# EAGLE design flokati-proto-r2 (EAGLE 6.2)
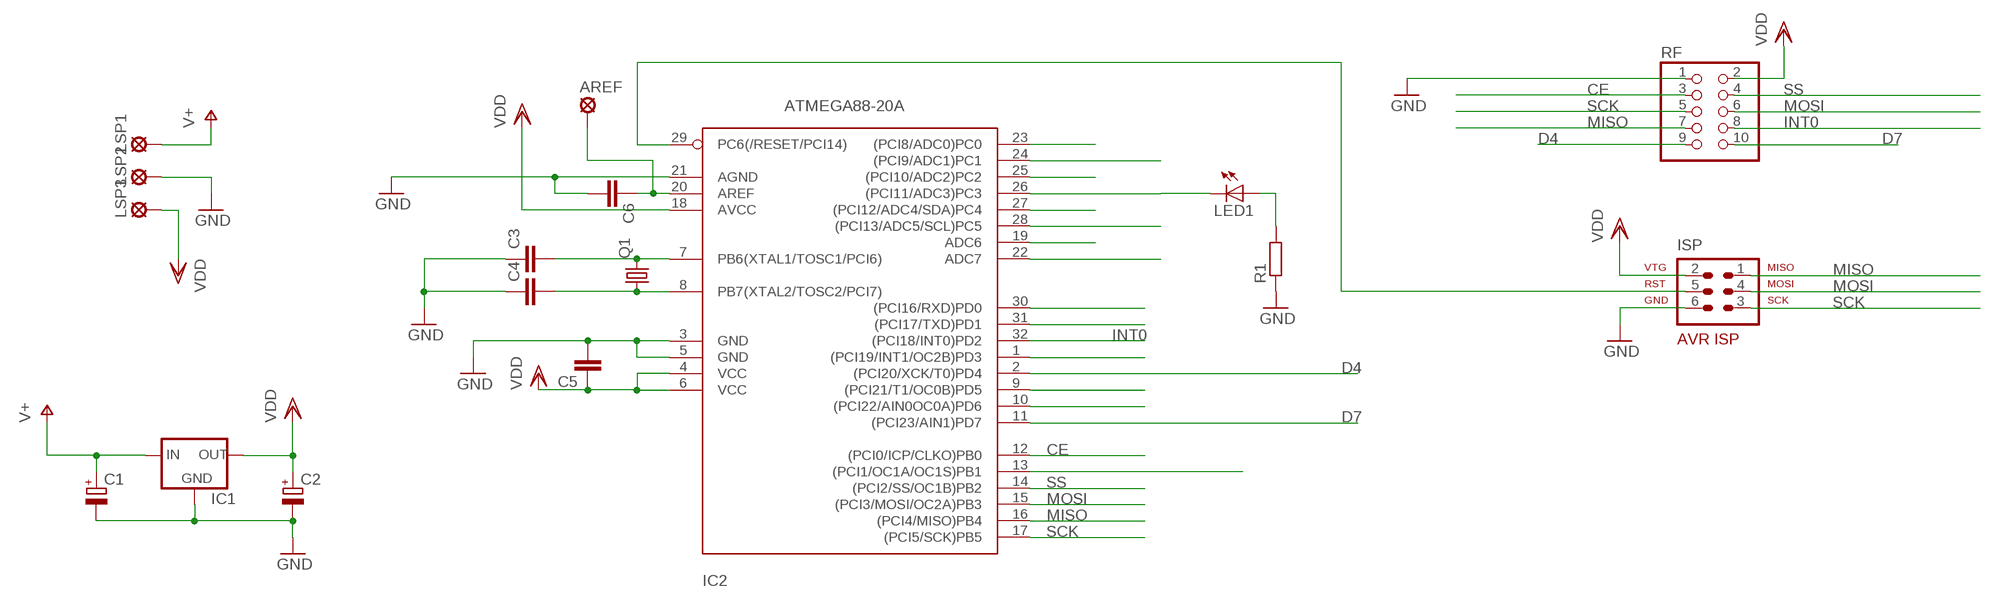
[diagram p0: schematic, sheet 1]

## Parts
AREF  LSP10  [LSP10]
C1  CPOL-EUE2-4  [E2-4]
C2  CPOL-EUE2-4  [E2-4]
C3  C-EUC0805K  [C0805K]
C4  C-EUC0805K  [C0805K]
C5  C-EUC0805K  [C0805K]
C6  C-EUC0805K  [C0805K]
IC1  78XXS  [78XXS]
IC2  ATMEGA88-20A  [TQFP32-08]
ISP  AVR-ISP-6  [AVR-ISP-6]
LED1  LEDCHIP-LED0805  [CHIP-LED0805]
LSP1  LSP11  [LSP11]
LSP2  LSP11  [LSP11]
LSP3  LSP11  [LSP11]
Q1  CRYSTALHC49U70  [HC49U70]
R1  R-EU_M0805  [M0805]
RF  PINHD-2X5  [2X05]

## Nets
CE: IC2.12((PCI0/ICP/CLKO)PB0) RF.3
D4: IC2.2((PCI20/XCK/T0)PD4) RF.9
D7: IC2.11((PCI23/AIN1)PD7) RF.10
GND: C1.- C2.- C3.1 C4.1 C5.2 C6.2 IC1.GND IC2.3(GND) IC2.5(GND) IC2.21(AGND) ISP.6 LSP2.MP R1.1 RF.1
INT0: IC2.32((PCI18/INT0)PD2) RF.8
MISO: IC2.16((PCI4/MISO)PB4) ISP.1 RF.7
MOSI: IC2.15((PCI3/MOSI/OC2A)PB3) ISP.4 RF.6
N$1: C3.2 IC2.7(PB6(XTAL1/TOSC1/PCI6)) Q1.2
N$2: C4.2 IC2.8(PB7(XTAL2/TOSC2/PCI7)) Q1.1
N$3: AREF.MP C6.1 IC2.20(AREF)
N$4: IC2.29(PC6(/RESET/PCI14)) ISP.5
N$5: IC2.23((PCI8/ADC0)PC0)
N$6: IC2.24((PCI9/ADC1)PC1)
N$9: IC2.27((PCI12/ADC4/SDA)PC4)
N$10: IC2.28((PCI13/ADC5/SCL)PC5)
N$11: IC2.19(ADC6)
N$12: IC2.22(ADC7)
N$13: IC2.30((PCI16/RXD)PD0)
N$14: IC2.31((PCI17/TXD)PD1)
N$15: IC2.1((PCI19/INT1/OC2B)PD3)
N$17: IC2.9((PCI21/T1/OC0B)PD5)
N$18: IC2.10((PCI22/AIN0OC0A)PD6)
N$20: IC2.13((PCI1/OC1A/OC1S)PB1)
N$22: IC2.26((PCI11/ADC3)PC3) LED1.C
N$23: IC2.25((PCI10/ADC2)PC2)
N$53: LED1.A R1.2
SCK: IC2.17((PCI5/SCK)PB5) ISP.3 RF.5
SS: IC2.14((PCI2/SS/OC1B)PB2) RF.4
V+: C1.+ IC1.IN LSP1.MP
VDD: C2.+ C5.1 IC1.OUT IC2.4(VCC) IC2.6(VCC) IC2.18(AVCC) ISP.2 LSP3.MP RF.2

## Library data of the parts
AREF = solpad:LSP10: SOLDER PAD drill 1.0 mm, distributor Buerklin, 12H555
C1 C2 = rcl:CPOL-EU: POLARIZED CAPACITOR, European symbol
C3-C6 = rcl:C-EU: CAPACITOR, European symbol
IC1 = v-reg:78XXS: VOLTAGE REGULATOR
IC2 = avr:ATMEGA88: MICROCONTROLLER 8 kBytes FLASH 1 kBytes SRAM 512 Bytes EEPROM USART 8-channel 10 bit ADC
ISP = avr-6:AVR-ISP-6: AVR ISP-6 Serial Programming Header
LED1 = led:LED: LED OSRAM: - CHIPLED LG R971, LG N971, LY N971, LG Q971, LY Q971, LO R971, LY R971 LH N974, LH R974 LS Q976, LO Q976, LY Q976 LO Q996 - Hyper CHIPLED LW Q18S LB Q993, LB Q99A, LB R99A - SideLED LS A670, LO A670, LY A670, LG A670, LP A670 LB A673, LV A673, LT A673, LW A673 LH A674 LY A675 LS A676, LA A676, LO A676, LY A676, LW A676 LS A679, LY A679, LG A679 - Hyper Micro SIDELED® LS Y876, LA Y876, LO Y876, LY Y876 LT Y87S - SmartLED LW L88C, LW L88S LB L89C, LB L89S, LG L890 LS L89K, LO L89K, LY L89K LS L896, LA L896, LO L896, LY L896 - TOPLED LS T670, LO T670, LY T670, LG T670, LP T670 LSG T670, LSP T670, LSY T670, LOP T670, LYG T670 LG T671, LOG T671, LSG T671 LB T673, LV T673, LT T673, LW T673 LH T674 LS T676, LA T676, LO T676, LY T676, LB T676, LH T676, LSB T676, LW T676 LB T67C, LV T67C, LT T67C, LS T67K, LO T67K, LY T67K, LW E67C LS E67B, LA E67B, LO E67B, LY E67B, LB E67C, LV E67C, LT E67C LW T67C LS T679, LY T679, LG T679 LS T770, LO T770, LY T770, LG T770, LP T770 LB T773, LV T773, LT T773, LW T773 LH T774 LS E675, LA E675, LY E675, LS T675 LS T776, LA T776, LO T776, LY T776, LB T776 LHGB T686 LT T68C, LB T68C - Hyper Mini TOPLED® LB M676 - Mini TOPLED Santana® LG M470 LS M47K, LO M47K, LY M47K Source: http://www.osram.convergy.de - LUMILED® LXK2-PW12-R00, LXK2-PW12-S00, LXK2-PW14-U00, LXK2-PW14-V00 LXK2-PM12-R00, LXK2-PM12-S00, LXK2-PM14-U00 LXK2-PE12-Q00, LXK2-PE12-R00, LXK2-PE12-S00, LXK2-PE14-T00, LXK2-PE14-U00 LXK2-PB12-K00, LXK2-PB12-L00, LXK2-PB12-M00, LXK2-PB14-N00, LXK2-PB14-P00, LXK2-PB14-Q00 LXK2-PR12-L00, LXK2-PR12-M00, LXK2-PR14-Q00, LXK2-PR14-R00 LXK2-PD12-Q00, LXK2-PD12-R00, LXK2-PD12-S00 LXK2-PH12-R00, LXK2-PH12-S00 LXK2-PL12-P00, LXK2-PL12-Q00, LXK2-PL12-R00 Source: www.luxeon.com
LSP1-LSP3 = solpad:LSP11: SOLDER PAD drill 1.1 mm
Q1 = crystal:CRYSTAL: CRYSTAL
R1 = rcl:R-EU_: RESISTOR, European symbol
RF = pinhead:PINHD-2X5: PIN HEADER

## Board
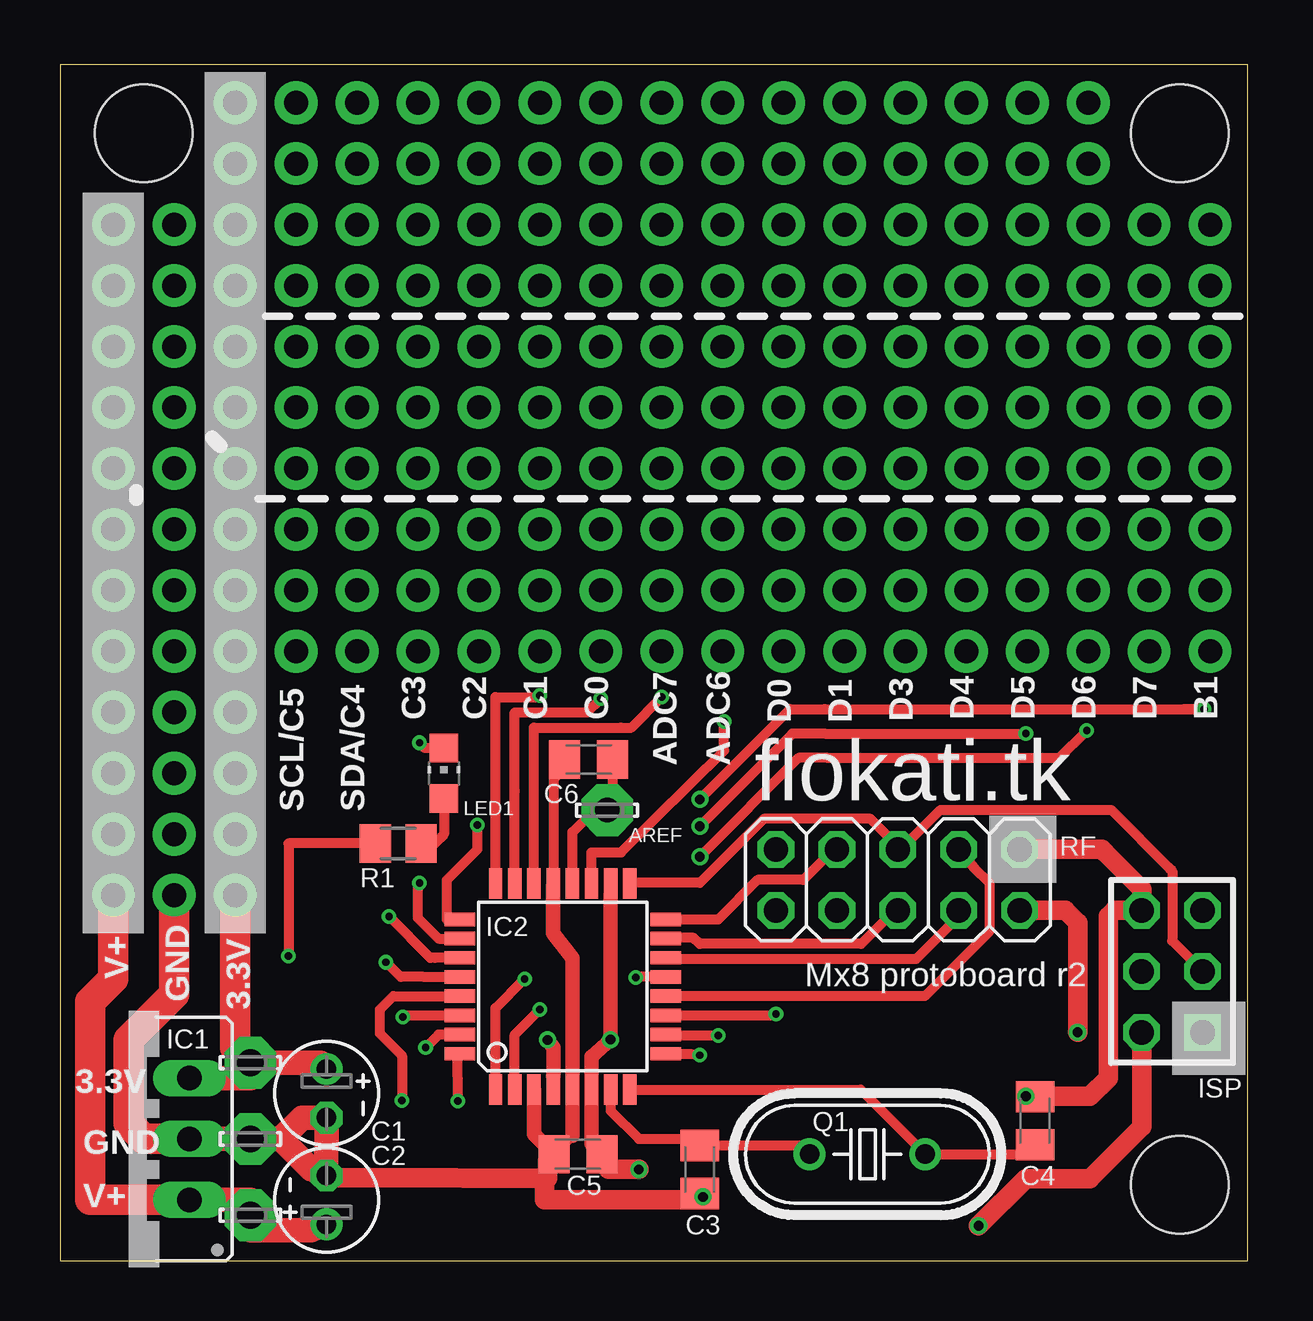
[diagram p1: board, top side]
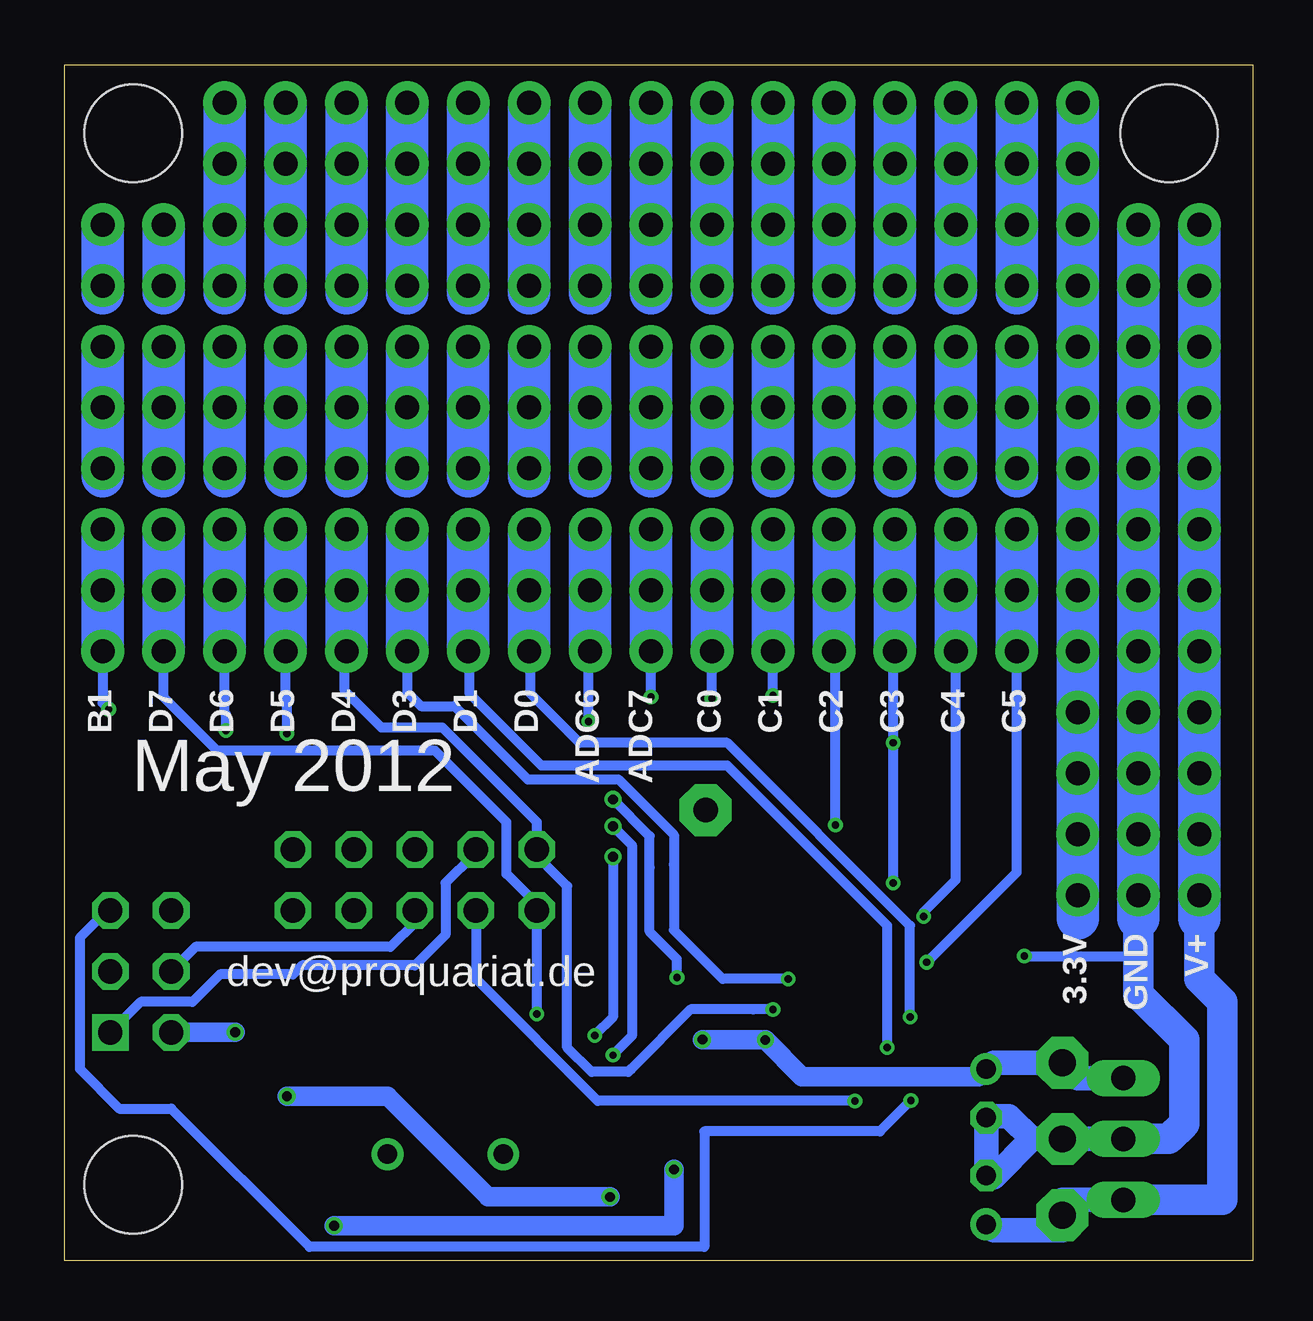
[diagram p2: board, bottom side, seen from below]

Size 49.52 x 49.84 mm. Coordinates in mm from the lower left corner, seen from the top.
Outline: 0,0 49.52,0 49.52,49.84 0,49.84 0,0
Copper layers (1*16): Top 0.035mm / dielectric 1.5mm / Bottom 0.035mm
Design rules: minimum track width 6mil, minimum drill 12mil, track to track 6mil, track to pad 6mil, pad to pad 6mil, via to via 6mil, smd to smd 0mil, copper to edge 10mil, drill to drill 10mil, minimum pad ring 10mil, minimum via ring 6mil, stop-mask expansion 2mil, vias tented up to drill 100mil, thermal gap 10mil
Holes 4.06 mm at 3.49,46.99 46.67,46.99 46.67,3.17

### Footprints (pad centres in the part's own frame; a part is rotated, then mirrored left to right if it is on the bottom)
LSP10 = drill 1.016 pad 2.159 octagon: MP 0,0
E2-4 = drill 0.813 pad 1.27: + -1.016,0 | drill 0.813 pad 1.27 octagon: - 1.016,0
C0805K = smd 1.3 x 1.6: 1 -1,0; 2 1,0
78XXS = drill 1.016 long: GND 0,-2.54; IN -2.54,-2.54; OUT 2.54,-2.54
TQFP32-08 = smd 1.27 x 0.559: 1 -4.293,2.8; 2 -4.293,2; 3 -4.293,1.2; 4 -4.293,0.4; 5 -4.293,-0.4; 6 -4.293,-1.2; 7 -4.293,-2; 8 -4.293,-2.8; 17 4.293,-2.8; 18 4.293,-2; 19 4.293,-1.2; 20 4.293,-0.4; 21 4.293,0.4; 22 4.293,1.2; 23 4.293,2; 24 4.293,2.8 | smd 0.559 x 1.27: 9 -2.8,-4.293; 10 -2,-4.293; 11 -1.2,-4.293; 12 -0.4,-4.293; 13 0.4,-4.293; 14 1.2,-4.293; 15 2,-4.293; 16 2.8,-4.293; 25 2.8,4.293; 26 2,4.293; 27 1.2,4.293; 28 0.4,4.293; 29 -0.4,4.293; 30 -1.2,4.293; 31 -2,4.293; 32 -2.8,4.293
AVR-ISP-6 = drill 1.016 square: 1 -2.54,-1.27 | drill 1.016 octagon: 2 -2.54,1.27; 3 0,-1.27; 4 0,1.27; 5 2.54,-1.27; 6 2.54,1.27
CHIP-LED0805 = smd 1.2 x 1.2: A 0,-1.05; C 0,1.05
LSP11 = drill 1.118 pad 2.159 octagon: MP 0,0
HC49U70 = drill 0.813: 1 -2.413,0; 2 2.413,0
M0805 = smd 1.3 x 1.6: 1 -0.95,0; 2 0.95,0
2X05 = drill 1.016 octagon: 1 -5.08,-1.27; 2 -5.08,1.27; 3 -2.54,-1.27; 4 -2.54,1.27; 5 0,-1.27; 6 0,1.27; 7 2.54,-1.27; 8 2.54,1.27; 9 5.08,-1.27; 10 5.08,1.27

### Placement (x,y rotation side)
AREF  22.81,18.78 0 top
C1  11.11,2.54 90 top
C2  11.11,6.99 270 top
C3  26.67,3.81 90 top
C4  40.64,5.84 270 top
C5  21.59,4.45 180 top
C6  22.03,20.89 180 top
IC1  2.86,5.08 90 top
IC2  20.95,11.43 90 top
ISP  46.35,12.06 90 top
LED1  16,20.32 0 top
LSP1  7.94,1.91 0 top
LSP2  7.94,5.08 0 top
LSP3  7.94,8.26 0 top
Q1  33.66,4.45 180 top
R1  14.1,17.4 0 top
RF  34.92,15.88 180 top

### Tracks (layer width: path | path; a pad name or v marks a point on that pad's centre or on a via)
CE
  Top 0.406: IC2.12 36.05,11.03 38.73,13.72 38.73,15.75 38.1,16.38 RF.3
D4  (via drill 0.3, 1 pad 1.78)
  Top 0.406: IC2.2 18.95,9.43 v20,10.48
  Bottom 0.406: v20,10.48 20.83,10.48 23.43,10.48 25.91,8 26.04,7.87 27.56,7.87 28.57,8.89 28.57,15.62 30.23,17.27 29.72,17.27 RF.9 29.84,18.29 33.78,22.23 36.32,22.23 37.85,23.75 37.85,25.34 v37.78,25.4
  Bottom 1.778: v37.78,27.94 v37.78,25.4 v37.78,27.94 | v37.78,27.94 v37.78,30.48 v37.78,27.94
D7  (via drill 0.3 pad 0.41, 1 pad 1.78)
  Top 0.406: IC2.11 29.79,10.23 v29.84,10.29
  Bottom 0.406: v45.4,25.4 45.4,23.5 43.88,21.97 43.18,21.27 34.1,21.27 31.11,18.29 31.11,16.13 29.84,14.86 29.84,14.73 RF.10 29.84,14.22 29.84,12.95 v29.84,10.29
  Bottom 1.778: v45.4,25.4 v45.4,27.94 v45.4,30.48
GND  (via drill 0.3 pad 0.41, 0.41 pad 0.41, 1 pad 1.78)
  Top 0.254: C5.2 20.32,3.81
  Top 0.406: C5.2 21.36,5.21 | 26.4,2.54 C3.1 26.67,2.79 v26.8,2.67 | 20.56,15.63 IC2.21 20.57,15.74 20.57,20.07 21.04,20.53 C6.2 | R1.1 9.53,17.4 v9.53,12.7 | v40.26,6.86 40.27,6.84 C4.1 40.66,6.86 | 43.43,17.14 43.56,17.02
  Top 0.61: 21.36,5.21 IC2.5 21.36,12.62 20.56,13.64 20.56,15.63 | IC2.3 19.75,5.28 C5.2
  Top 0.813: 11.09,3.46 16.49,3.46 16.83,3.45 20.19,3.45 | 20.19,3.45 20.32,3.45 20.32,4.17 C5.2 | 26.4,2.54 20.19,2.54 20.19,3.45 | 43.56,17.02 45.09,15.49 ISP.6 43.94,14.61 43.69,14.35 43.69,7.62 42.93,6.86 40.66,6.86 | RF.1 43.43,17.14
  Top 1.016: 9.21,5.08 10.48,3.81 C1.- | 9.21,5.08 LSP2.MP IC1.GND | 9.21,5.08 10.1,5.97 C2.- 11.09,3.46
  Top 1.27: IC1.GND 3.49,5.08 2.86,5.71 2.86,9.21 4.76,11.11 v4.76,15.24
  Bottom 0.406: v9.53,12.7 4.76,12.7
  Bottom 0.813: v26.8,2.67 31.88,2.67 36.07,6.86 v40.26,6.86
  Bottom 1.016: IC1.GND 9.21,5.08 | 9.21,5.08 10.16,6.03 11.11,6.03 11.11,3.49 10.79,3.49 9.21,5.08
  Bottom 1.27: 4.76,14.29 4.76,12.7 4.76,11.11 2.86,9.21 2.86,5.71 3.49,5.08 IC1.GND
  Bottom 1.778: 4.76,14.29 v4.76,15.24 v4.76,17.78 v4.76,20.32 v4.76,22.86 v4.76,25.4 v4.76,27.94 v4.76,30.48 v4.76,33.02 v4.76,35.56 v4.76,38.1 v4.76,40.64 v4.76,43.18
INT0  (via drill 0.3)
  Top 0.406: IC2.32 16.57,8.63 v16.59,6.67
  Bottom 0.406: v16.59,6.67 27.3,6.67 32.38,11.75 RF.8
MISO
  Top 0.406: RF.7 32.13,17.02 30.99,15.88 29.08,15.88 27.43,14.22 IC2.16
  Bottom 0.406: RF.7 32.38,16.89 32.51,16.89 33.66,15.75 33.66,13.59 34.92,12.32 39.62,12.32 40.01,11.94 43.05,11.94 44.07,10.92 44.2,10.79 46.35,10.79 ISP.1
MOSI
  Top 0.406: RF.6 34.67,14.48 33.4,13.21 26.67,13.21 26.42,13.46 25.28,13.46 IC2.15
  Bottom 0.406: RF.6 34.92,14.1 35.94,13.08 44.07,13.08 ISP.4
N$1
  Top 0.406: IC2.7 22.95,6.25 24.13,5.08 26.4,5.08 C3.2 30.88,4.81 Q1.2
N$2
  Top 0.406: IC2.8 33.38,7.14 Q1.1 40.27,4.45 C4.2
N$3
  Top 0.406: IC2.20 21.36,17.86 22.54,19.05 22.92,19.05 AREF.MP 23.04,19 C6.1
N$4  (via drill 0.3)
  Top 0.406: IC2.29 13.89,11.03 13.34,10.48 13.34,9.53 13.34,9.47 14.25,8.56 v14.25,6.69
  Bottom 0.406: v14.25,6.69 15.54,5.4 22.86,5.4 22.86,0.58 39.32,0.58 45.09,6.35 47.24,6.35 48.9,8 48.9,13.46 47.75,14.61 ISP.5
N$5  (via drill 0.3 pad 0.41, 1 pad 1.78)
  Top 0.406: IC2.23 18.95,19.59 18.95,22.86 21.59,22.86 21.97,22.86 v22.54,23.43
  Bottom 0.406: v22.54,23.43 v22.54,25.4
  Bottom 1.778: v22.54,25.4 v22.54,27.94 v22.54,30.48
N$6  (via drill 0.3 pad 0.41, 1 pad 1.78)
  Top 0.406: IC2.24 18.16,23.49 19.94,23.49 19.94,23.5 v20,23.56
  Bottom 0.406: v20,23.56 v20,25.4
  Bottom 1.778: v20,25.4 v20,27.94 v20,30.48
N$7  (via drill 1 pad 1.78)
  Bottom 1.778: 12.38,40.32 v12.38,40.64 v12.38,43.18 v12.38,45.72 v12.38,48.26
N$8  (via drill 1 pad 1.78)
  Bottom 1.778: 9.84,32.7 v9.84,33.02 v9.84,35.56 v9.84,38.1
N$9  (via drill 0.3 pad 0.41, 1 pad 1.78)
  Top 0.406: IC2.27 15.63,12.63 15.44,12.63 v13.72,14.35
  Bottom 0.406: v12.38,25.4 12.38,15.88 13.72,14.54 v13.72,14.35
  Bottom 1.778: v12.38,25.4 v12.38,27.94 v12.38,30.48
N$10  (via drill 0.3 pad 0.41, 1 pad 1.78)
  Top 0.406: IC2.28 15.16,11.83 14.21,11.83 v13.59,12.45
  Bottom 0.406: v9.84,25.4 9.84,17.14 9.84,16.19 v13.59,12.45
  Bottom 1.778: v9.84,25.4 v9.84,27.94 v9.84,30.48
N$11  (via drill 0.3 pad 0.41, 1 pad 1.78)
  Top 0.406: IC2.19 22.16,17.02 23.39,17.02 27.69,21.26 v27.69,22.48
  Bottom 0.406: v27.69,22.48 27.69,25.34 v27.62,25.4
  Bottom 1.778: v27.62,25.4 v27.62,27.94 v27.62,30.48
N$12  (via drill 0.3 pad 0.41, 1 pad 1.78)
  Top 0.406: IC2.22 19.75,18.17 19.75,22.23 23.37,22.23 23.81,22.23 v25.08,23.5
  Bottom 0.406: v25.08,23.5 v25.08,25.4
  Bottom 1.778: v25.08,25.4 v25.08,27.94 v25.08,30.48
N$13  (via drill 0.3, 1 pad 1.78)
  Top 0.406: IC2.30 14.36,10.23 v14.29,10.16
  Bottom 0.406: v14.29,10.16 14.29,13.97 21.91,21.59 28.07,21.59 30.1,23.62 30.1,25.34 v30.16,25.4
  Bottom 1.778: v30.16,25.4 v30.16,27.94 v30.16,30.48
N$14  (via drill 0.3, 1 pad 1.78)
  Top 0.406: IC2.31 15.78,9.43 v15.24,8.89
  Bottom 0.406: v15.24,8.89 15.24,13.97 21.91,20.64 29.65,20.64 32.64,23.62 32.64,25.34 v32.7,25.4
  Bottom 1.778: v32.7,25.4 v32.7,27.94 v32.7,30.48
N$15  (via drill 0.3, 1 pad 1.78)
  Top 0.406: IC2.1 18.16,10.54 v19.37,11.75
  Bottom 0.406: v19.37,11.75 22.1,11.75 24.13,13.78 24.13,16.51 24.13,17.75 26.44,20.07 27.33,20.07 30.23,20.07 33.27,23.11 34.67,23.11 35.24,23.69 v35.24,25.4
  Bottom 1.778: v35.24,25.4 v35.24,27.94 v35.24,30.48
N$16  (via drill 1 pad 1.78)
  Bottom 1.778: 12.38,32.7 v12.38,33.02 v12.38,35.56 v12.38,38.1
N$17  (via drill 0.3, 0.3 pad 0.41, 0.41 pad 0.41, 1 pad 1.78)
  Top 0.406: IC2.9 26.3,8.63 v26.67,8.57 | v40.26,21.97 31.88,21.97 30.53,21.97 v26.67,18.11
  Bottom 0.406: v26.67,8.57 26.67,8.59 25.88,9.37 25.88,17.32 v26.67,18.11 | v40.32,25.4 40.32,23.5 40.26,23.43 v40.26,21.97
  Bottom 1.778: v40.32,25.4 v40.32,27.94 v40.32,30.48
N$18  (via drill 0.3 pad 0.41, 0.41 pad 0.41, 1 pad 1.78)
  Top 0.406: IC2.10 25.28,9.4 v27.43,9.4 | v42.8,22.1 41.66,20.95 32,20.95 30.79,20.95 v26.67,16.84
  Bottom 0.406: v42.86,25.4 42.86,22.86 42.8,22.8 v42.8,22.1 | v26.67,16.84 26.67,10.16 v27.43,9.4
  Bottom 1.778: v42.86,25.4 v42.86,27.94 v42.86,30.48
N$20  (via drill 0.3 pad 0.41, 0.41 pad 0.41, 1 pad 1.78)
  Top 0.406: IC2.13 24.02,11.83 v24,11.81 | 46.86,22.99 31.88,22.99 30.43,22.99 v26.67,19.23 | 46.86,22.99 v47.69,22.99 46.86,22.99
  Bottom 0.406: v24,11.81 24,12.57 25.15,13.72 25.15,16.38 25.15,17.7 v26.67,19.23 | v47.94,25.4 47.94,23.24 v47.69,22.99
  Bottom 1.778: v47.94,25.4 v47.94,27.94 v47.94,30.48
N$21  (via drill 1 pad 1.78)
  Bottom 1.778: v14.92,38.1 v14.92,35.56 v14.92,33.02 14.92,32.7
N$22  (via drill 0.3 pad 0.41, 1 pad 1.78)
  Top 0.406: IC2.26 15.78,13.43 14.92,14.29 14.92,15.68 v14.99,15.75 | LED1.C 15.21,21.37 v14.99,21.59
  Bottom 0.406: v14.99,15.75 v14.99,21.59 | v14.99,21.59 14.99,22.1 | 14.99,22.1 14.99,25.34 v14.92,25.4 | v14.99,21.59 14.99,22.1
  Bottom 1.778: v14.92,27.94 v14.92,25.4 v14.92,27.94 | v14.92,27.94 v14.92,30.48 v14.92,27.94
N$23  (via drill 0.3 pad 0.41, 1 pad 1.78)
  Top 0.406: IC2.25 16.13,14.23 16.13,15.75 16.13,15.88 17.4,17.14 v17.4,18.16
  Bottom 0.406: v17.4,18.16 17.4,25.34 v17.46,25.4
  Bottom 1.778: v17.46,27.94 v17.46,25.4 v17.46,27.94 | v17.46,27.94 v17.46,30.48 v17.46,27.94
N$25  (via drill 1 pad 1.78)
  Bottom 1.778: 17.46,32.7 v17.46,33.02 v17.46,35.56 v17.46,38.1
N$26  (via drill 1 pad 1.78)
  Bottom 1.778: 20,32.7 v20,33.02 v20,35.56 v20,38.1
N$27  (via drill 1 pad 1.78)
  Bottom 1.778: 22.54,32.7 v22.54,33.02 v22.54,35.56 v22.54,38.1
N$28  (via drill 1 pad 1.78)
  Bottom 1.778: 25.08,32.7 v25.08,33.02 v25.08,35.56 v25.08,38.1
N$29  (via drill 1 pad 1.78)
  Bottom 1.778: 27.62,32.7 v27.62,33.02 v27.62,35.56 v27.62,38.1
N$30  (via drill 1 pad 1.78)
  Bottom 1.778: 30.16,32.7 v30.16,33.02 v30.16,35.56 v30.16,38.1
N$31  (via drill 1 pad 1.78)
  Bottom 1.778: 32.7,32.7 v32.7,33.02 v32.7,35.56 v32.7,38.1
N$32  (via drill 1 pad 1.78)
  Bottom 1.778: 35.24,32.7 v35.24,33.02 v35.24,35.56 v35.24,38.1
N$33  (via drill 1 pad 1.78)
  Bottom 1.778: 37.78,32.7 v37.78,33.02 v37.78,35.56 v37.78,38.1
N$34  (via drill 1 pad 1.78)
  Bottom 1.778: v40.32,38.1 v40.32,35.56 v40.32,33.02 40.32,32.7
N$35  (via drill 1 pad 1.78)
  Bottom 1.778: v42.86,38.1 v42.86,35.56 v42.86,33.02 42.86,32.7
N$36  (via drill 1 pad 1.78)
  Bottom 1.778: v45.4,38.1 v45.4,35.56 v45.4,33.02 45.4,32.7
N$37  (via drill 1 pad 1.78)
  Bottom 1.778: v47.94,38.1 v47.94,35.56 v47.94,33.02 47.94,32.7
N$38  (via drill 1 pad 1.78)
  Bottom 1.778: 9.84,40.32 v9.84,40.64 v9.84,43.18 v9.84,45.72 v9.84,48.26
N$39  (via drill 1 pad 1.78)
  Bottom 1.778: 14.92,40.32 v14.92,40.64 v14.92,43.18 v14.92,45.72 v14.92,48.26
N$40  (via drill 1 pad 1.78)
  Bottom 1.778: 17.46,40.32 v17.46,40.64 v17.46,43.18 v17.46,45.72 v17.46,48.26
N$41  (via drill 1 pad 1.78)
  Bottom 1.778: 20,40.32 v20,40.64 v20,43.18 v20,45.72 v20,48.26
N$42  (via drill 1 pad 1.78)
  Bottom 1.778: 22.54,40.32 v22.54,40.64 v22.54,43.18 v22.54,45.72 v22.54,48.26
N$43  (via drill 1 pad 1.78)
  Bottom 1.778: 25.08,40.32 v25.08,40.64 v25.08,43.18 v25.08,45.72 v25.08,48.26
N$44  (via drill 1 pad 1.78)
  Bottom 1.778: 27.62,40.32 v27.62,40.64 v27.62,43.18 v27.62,45.72 v27.62,48.26
N$45  (via drill 1 pad 1.78)
  Bottom 1.778: 30.16,40.32 v30.16,40.64 v30.16,43.18 v30.16,45.72 v30.16,48.26
N$46  (via drill 1 pad 1.78)
  Bottom 1.778: 32.7,40.32 v32.7,40.64 v32.7,43.18 v32.7,45.72 v32.7,48.26
N$47  (via drill 1 pad 1.78)
  Bottom 1.778: 35.24,40.32 v35.24,40.64 v35.24,43.18 v35.24,45.72 v35.24,48.26
N$48  (via drill 1 pad 1.78)
  Bottom 1.778: 37.78,40.32 v37.78,40.64 v37.78,43.18 v37.78,45.72 v37.78,48.26
N$49  (via drill 1 pad 1.78)
  Bottom 1.778: 40.32,40.32 v40.32,40.64 v40.32,43.18 v40.32,45.72 v40.32,48.26
N$50  (via drill 1 pad 1.78)
  Bottom 1.778: 42.86,40.32 v42.86,40.64 v42.86,43.18 v42.86,45.72 v42.86,48.26
N$51  (via drill 1 pad 1.78)
  Bottom 1.778: v45.4,43.18 v45.4,40.64 45.4,40.32
N$52  (via drill 1 pad 1.78)
  Bottom 1.778: v47.94,43.18 v47.94,40.64 47.94,40.32
N$53
  Top 0.406: LED1.A 16,17.78 15.62,17.4 R1.2
SCK
  Top 0.406: 34.92,17.27 RF.5 34.92,17.27 | IC2.17 23.78,15.75 26.67,15.75 29.34,18.41 33.78,18.41 34.92,17.27 | ISP.3 46.35,13.34 46.35,16.26 46.23,16.38 43.81,18.8 36.7,18.8 35.18,17.27 34.92,17.27
SS
  Top 0.254: IC2.14 25.4,12.7
  Top 0.406: RF.4 37.47,14.35 35.69,12.57 25.3,12.57 IC2.14
V+  (via drill 1 pad 1.78)
  Top 0.254: 7.94,2.54 LSP1.MP
  Top 1.016: C1.+ 10.48,1.27 7.94,1.27 LSP1.MP | IC1.IN 7.94,2.54
  Top 1.27: IC1.IN 1.27,2.54 1.27,10.79 2.22,11.75 v2.22,15.24
  Bottom 1.016: IC1.IN 7.94,2.54 7.94,1.27 10.79,1.27 11.11,1.59
  Bottom 1.27: 2.22,14.29 2.22,11.75 1.27,10.79 1.27,2.54 IC1.IN
  Bottom 1.778: 2.22,14.29 v2.22,15.24 v2.22,17.78 v2.22,20.32 v2.22,22.86 v2.22,25.4 v2.22,27.94 v2.22,30.48 v2.22,33.02 v2.22,35.56 v2.22,38.1 v2.22,40.64 v2.22,43.18
VDD  (via drill 0.41, 0.41 pad 0.41, 1 pad 1.78)
  Top 0.254: C5.1 22.86,3.81 | 22.94,15.26 IC2.18 | 7.94,7.62 LSP3.MP
  Top 0.406: 22.16,4.88 C5.1 | 10.86,8.26 C2.+ | v20.32,9.21 20.35,9.18 | 20.55,7.69 20.64,7.22 IC2.4 | 45.09,7.49 45.09,7.37
  Top 0.61: 22.16,4.88 IC2.6 22.16,8.5 v22.94,9.22 22.94,15.26 | 20.35,9.18 20.57,8.89 20.57,7.69 20.55,7.69
  Top 0.813: 22.86,3.81 v24.13,3.81 | v38.29,1.46 40.26,3.43 41.66,3.43 42.93,3.43 45.09,5.59 45.09,7.37 45.09,7.49 ISP.2 | v42.42,9.53 42.42,13.34 42.42,14.1 41.91,14.61 RF.2
  Top 1.016: IC1.OUT 7.94,7.62 | LSP3.MP 10.86,8.26
  Top 1.27: LSP3.MP 7.3,8.89 v7.3,15.24
  Bottom 0.406: C2.+ 11.11,7.94 11.43,7.67 | LSP3.MP 7.3,8.89
  Bottom 0.813: v24.13,3.81 24.13,1.46 v38.29,1.46 | 11.43,7.67 18.8,7.68 v20.32,9.21 v22.94,9.22 | v42.42,9.53 ISP.2
  Bottom 1.016: IC1.OUT 7.3,7.62 LSP3.MP 10.79,8.26 11.11,7.94
  Bottom 1.778: 7.3,14.29 v7.3,15.24 v7.3,17.78 v7.3,20.32 v7.3,22.86 v7.3,25.4 v7.3,27.94 v7.3,30.48 v7.3,33.02 v7.3,35.56 v7.3,38.1 v7.3,40.64 v7.3,43.18 v7.3,45.72 v7.3,48.26

### Text on the board
tPlace: C3 | C2 | C1 | C0 | D4 | D5 | D6 | D7 | B1 | D0 | D1 | D3 | ADC7 | ADC6 | SCL/C5 | SDA/C4 | V+ | GND | 3.3V | 3.3V | GND | V+
bPlace: C5 | C4 | C3 | C2 | C1 | C0 | ADC7 | ADC6 | D0 | D1 | D3 | D4 | D5 | D6 | D7 | B1 | V+ | GND | 3.3V
tNames: flokati.tk | Mx8 protoboard r2
bNames: May 2012 | dev@proquariat.de